# Altium schematic sheet PowerMonitor.SchDoc
size 420 x 297 mm; Revision: 1.1.0; SheetNumber: 3; SheetTotal: 15
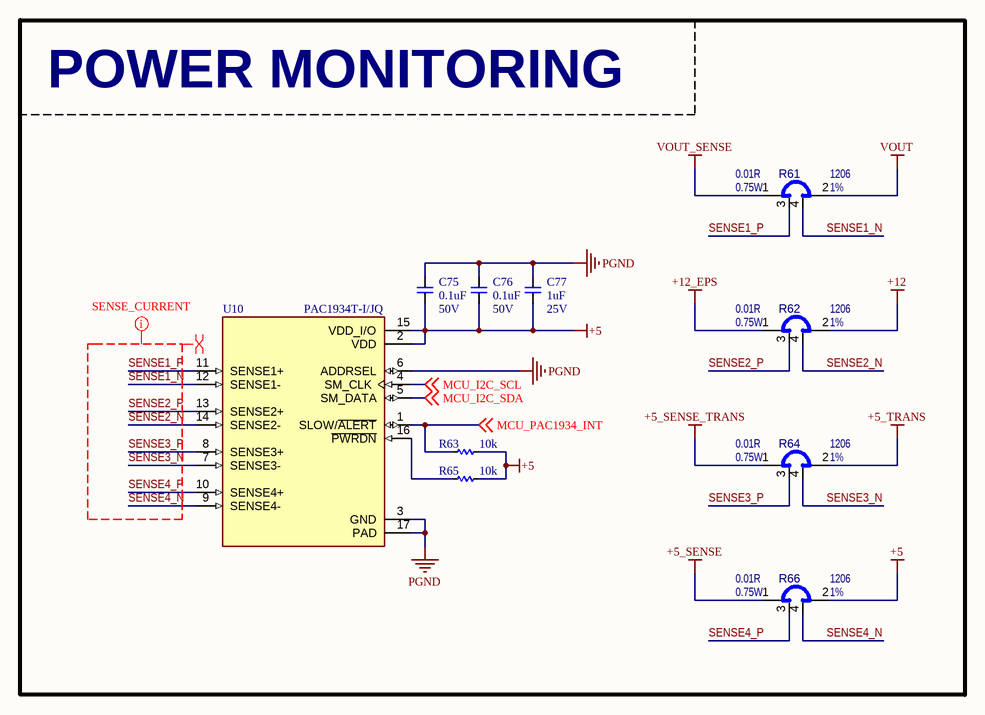
[diagram p0: PowerMonitor.SchDoc]

## Parts
C75  0.1uF  Voltage: 50V  [CAP_C_1608X80]
C76  0.1uF  Voltage: 50V  [CAP_C_1608X80]
C77  1uF  Voltage: 25V  [CAP_C_1608X80]
R61  value 0.01R  Package: 1206  Tolerance: 1%  Power: 0.75W  [RES_C_1206_SHUNT]  (hidden comment: Shunt 4 Pin)
R62  value 0.01R  Package: 1206  Tolerance: 1%  Power: 0.75W  [RES_C_1206_SHUNT]  (hidden comment: Shunt 4 Pin)
R63  10k  [RES_C_1608X60]
R64  value 0.01R  Package: 1206  Tolerance: 1%  Power: 0.75W  [RES_C_1206_SHUNT]  (hidden comment: Shunt 4 Pin)
R65  10k  [RES_C_1608X60]
R66  value 0.01R  Package: 1206  Tolerance: 1%  Power: 0.75W  [RES_C_1206_SHUNT]  (hidden comment: Shunt 4 Pin)
U10  PAC1934T-I/JQ  [QFN65]

## Blocks framed on the sheet
POWER MONITORING: C75-C77 R61-R66 U10

## Nets
+5: C75.2 C76.2 C77.2 R63.1 R65.2 R66.2 U10.2(VDD) U10.15(VDD_I/O)
+5_SENSE: R66.1
+5_SENSE_TRANS: R64.1
+5_TRANS: R64.2
+12: R62.2
+12_EPS: R62.1
PGND: C75.1 C76.1 C77.1 U10.3(GND) U10.6(ADDRSEL) U10.17(PAD)
VOUT: R61.2
VOUT_SENSE: R61.1
MCU_I2C_SCL: U10.4(SM_CLK) ; off-sheet MCU_I2C_SCL
MCU_I2C_SDA: U10.5(SM_DATA) ; off-sheet MCU_I2C_SDA
MCU_PAC1934_INT: R63.2 U10.1(SLOW/~{ALERT}) ; off-sheet MCU_PAC1934_INT
SENSE1_N: R61.4 U10.12(SENSE1-)
SENSE1_P: R61.3 U10.11(SENSE1+)
SENSE2_N: R62.4 U10.14(SENSE2-)
SENSE2_P: R62.3 U10.13(SENSE2+)
SENSE3_N: R64.4 U10.7(SENSE3-)
SENSE3_P: R64.3 U10.8(SENSE3+)
SENSE4_N: R66.4 U10.9(SENSE4-)
SENSE4_P: R66.3 U10.10(SENSE4+)
NetR65_1: R65.1 U10.16(~{PWRDN})

## Layout directives
differential pair: SENSE1_N, SENSE1_P, SENSE2_N, SENSE2_P, SENSE3_N, SENSE3_P, SENSE4_N, SENSE4_P
net class SENSE_CURRENT: SENSE1_N, SENSE1_P, SENSE2_N, SENSE2_P, SENSE3_N, SENSE3_P, SENSE4_N, SENSE4_P

## Notes on the sheet
- Project:
- DAL_PDU
- Sub-system:
- IGRVT-50
- Design by:
- KIEN HOANG
- BAO BUI
- Sheet title:
- Sheet
- A3
- of
- Checked by:
- Approved by:
- VU PHAM
- Revision:
- Document No:
- Size:
- Date:

## Library data of the parts
C75-C77 = _CAP_C_2: CAP
R61 R62 R64 R66 = RSMT1316: Shunt; Manufacturer 1: SUSUMU; Manufacturer Part Number 1: KRL1632E-M-R010-F-T5; Description_: RES SHUNT MF 0.01R 1% 0.75W SMD 1206; Dev Tools Status: Design; Temperature Coeffcient: 50ppm/C; Current: 8A; Owner: Ciprian Abramov; Populated: YES; MCHP-ID: RSMT1316; Revision: 1; Symbol: Shunt 4 Pin; Status: MCL Design; ComponentLink1URL: https://chn-vm-apps.microchip.com/mchprepo/parts/Datasheets/n_catalog_partition09_en.pdf; ComponentLink1Description: SVN Datasheet; ComponentLink2URL: C:\ALTIUM_WORK\00001_MCHP-CDB\Datasheets\n_catalog_partition09_en.pdf; ComponentLink2Description: Local Datasheet; ComponentLink3URL: C:\ALTIUM_WORK\00001_MCHP-CDB\Library\LibraryRefs\Shunt 4 Pin.SchLib; ComponentLink3Description: Open Symbol; ComponentLink4URL: C:\ALTIUM_WORK\00001_MCHP-CDB\Library\Footprints\RES_C_1206_SHUNT.PcbLib; ComponentLink4Description: Open Footprint; ComponentLink5Description: Open Footprint 2; ComponentLink6Description: Open Footprint 3; ComponentLink7Description: Open Footprint 4; Operating Temperature: -55C to +155C; Category: Resistor; Type: RES SMD; Composition: MF; Supplier 1: Digi-Key; Supplier Part Number 1: 408-1570-1-ND; Quantity Override: 1
R63 R65 = _RES_B_2_2: RES